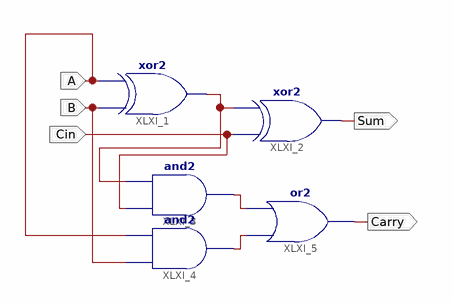
[diagram p0: schematic sheet 1]
// Xilinx ISE schematic Full_Adder.sch (spartan3) as structural Verilog: 5 symbols, 5 ports
module Full_Adder (
  input  A,
  input  B,
  input  Cin,
  output Sum,
  output Carry
);

  wire XLXN_4, XLXN_8, XLXN_11;

  xor XLXI_1 (XLXN_4, B, A);
  xor XLXI_2 (Sum, Cin, XLXN_4);
  and XLXI_3 (XLXN_8, Cin, XLXN_4);
  and XLXI_4 (XLXN_11, B, A);
  or XLXI_5 (Carry, XLXN_11, XLXN_8);
endmodule
